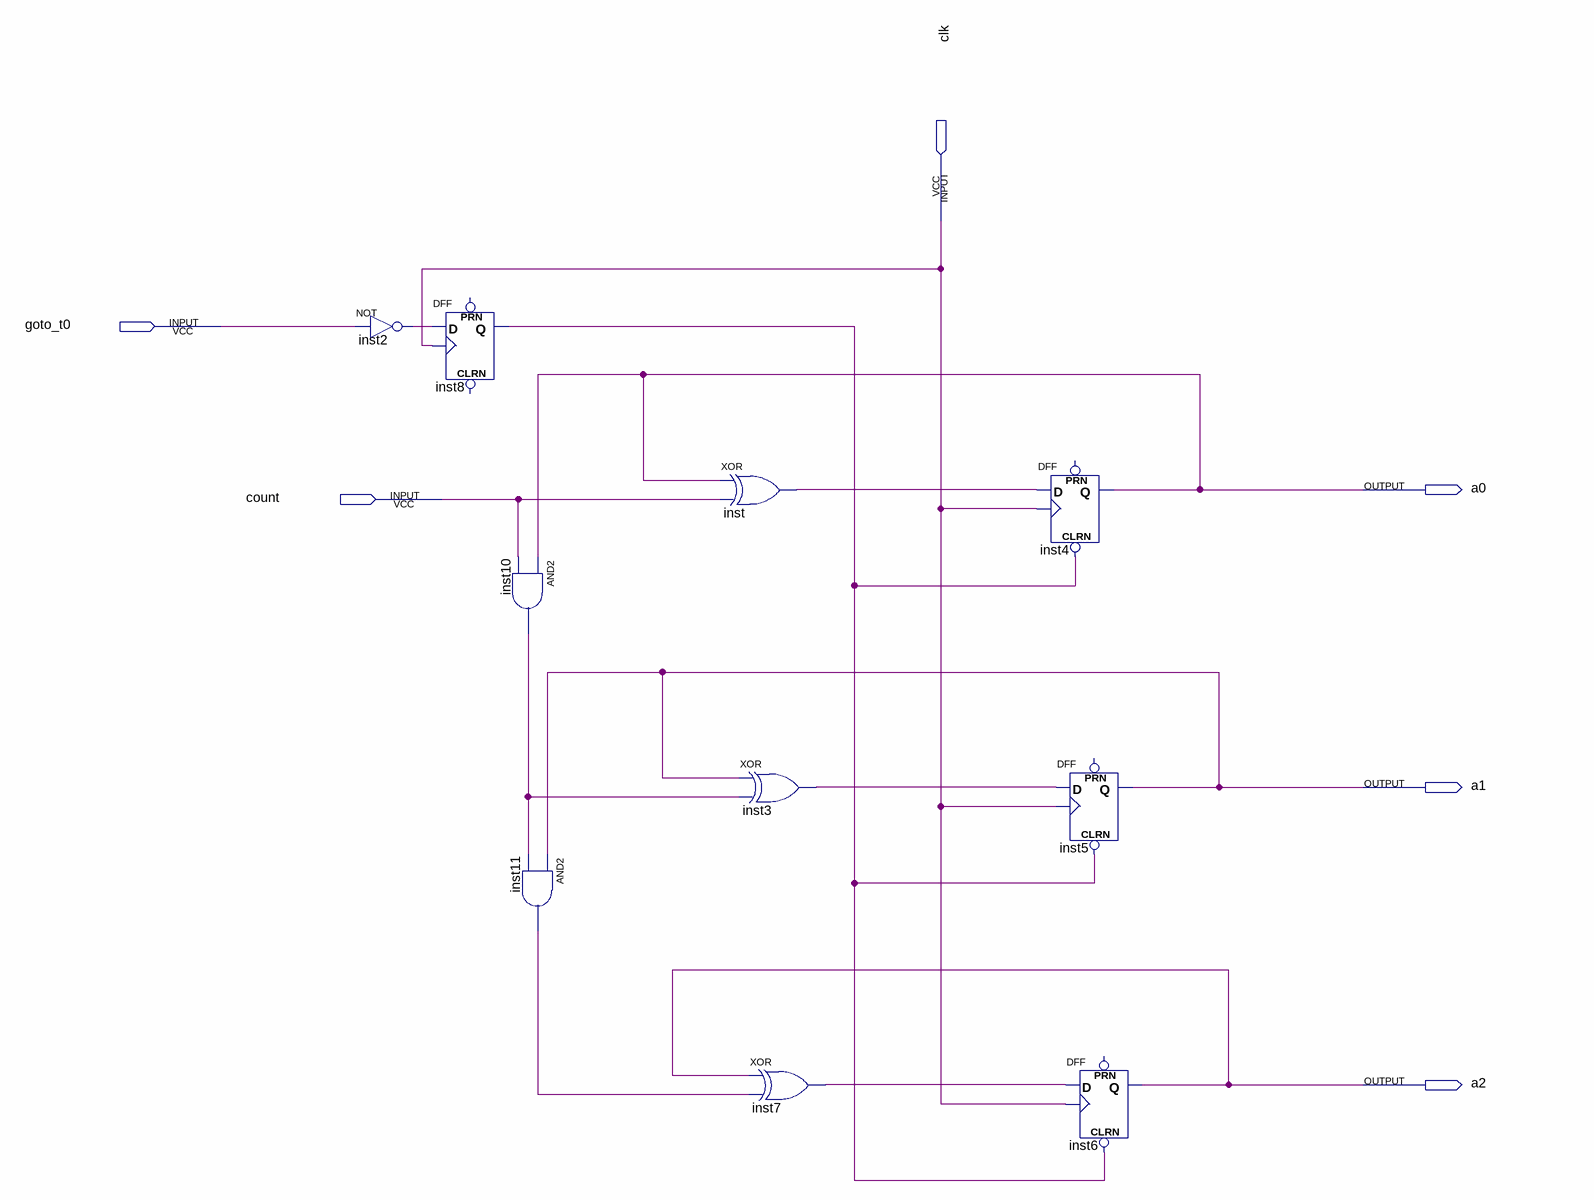
[diagram p0: schematic sheet]
// Quartus schematic contadortresbits.bdf as structural Verilog: 10 symbols, 6 pins
module contadortresbits (
  input  clk,
  input  goto_t0,
  input  count,
  output a0,
  output a1,
  output a2
);

  wire inst2_out, inst3_out, inst7_out, inst8_q, inst10_out, inst11_out, inst_out;

  not inst2 (inst2_out, goto_t0);
  DFF inst8 (.CLK(clk), .D(inst2_out), .Q(inst8_q));  // open: CLRN, PRN
  and inst10 (inst10_out, a0, count);
  and inst11 (inst11_out, a1, inst10_out);
  xor inst (inst_out, a0, count);
  xor inst3 (inst3_out, a1, inst10_out);
  xor inst7 (inst7_out, a2, inst11_out);
  DFF inst4 (.CLRN(inst8_q), .CLK(clk), .D(inst_out), .Q(a0));  // open: PRN
  DFF inst5 (.CLRN(inst8_q), .CLK(clk), .D(inst3_out), .Q(a1));  // open: PRN
  DFF inst6 (.CLRN(inst8_q), .CLK(clk), .D(inst7_out), .Q(a2));  // open: PRN
endmodule
